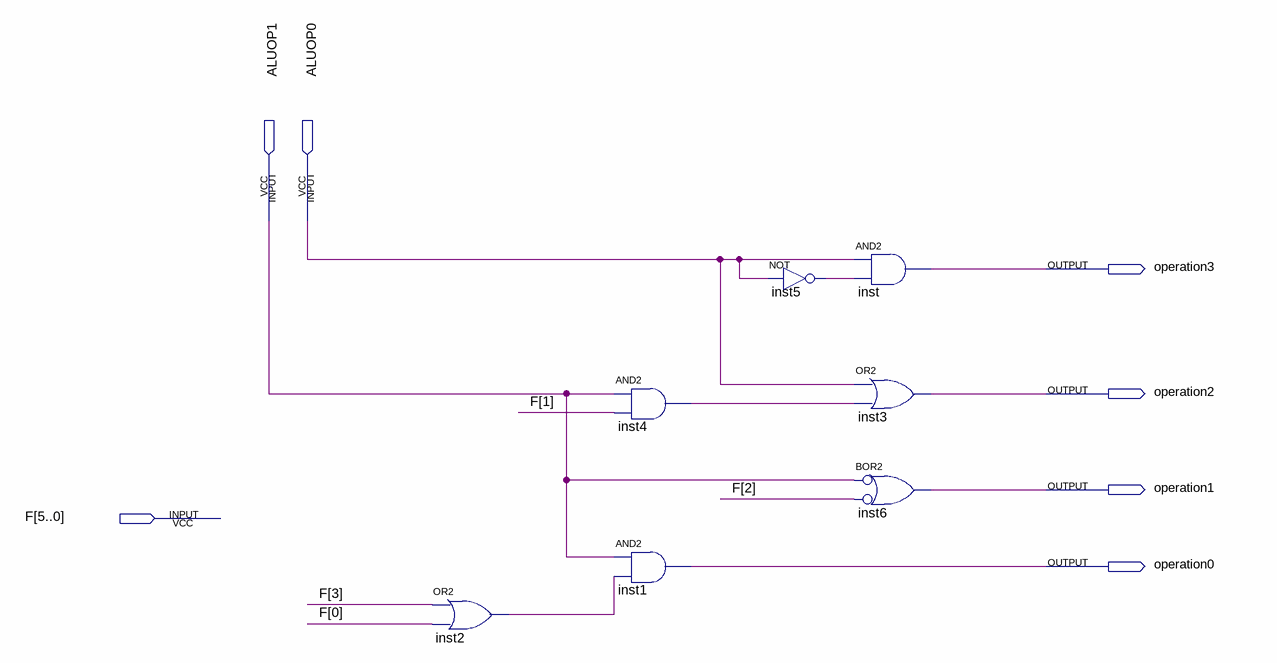
[diagram p0: schematic sheet]
// Quartus schematic AluControl.bdf as structural Verilog: 7 symbols, 7 pins
module AluControl (
  input  ALUOP1,
  input  ALUOP0,
  input  [5:0] F,
  output operation3,
  output operation2,
  output operation1,
  output operation0
);

  wire inst2_out, inst4_out, inst5_out;

  or inst2 (inst2_out, F[3], F[0]);
  and inst4 (inst4_out, ALUOP1, F[1]);
  and inst1 (operation0, ALUOP1, inst2_out);
  not inst5 (inst5_out, ALUOP0);
  and inst (operation3, ALUOP0, inst5_out);
  or inst3 (operation2, ALUOP0, inst4_out);
  or inst6 (operation1, ~ALUOP1, ~F[2]);  // BOR2
endmodule
